# EAGLE schematic PSU2 (EAGLE 9.4.2)
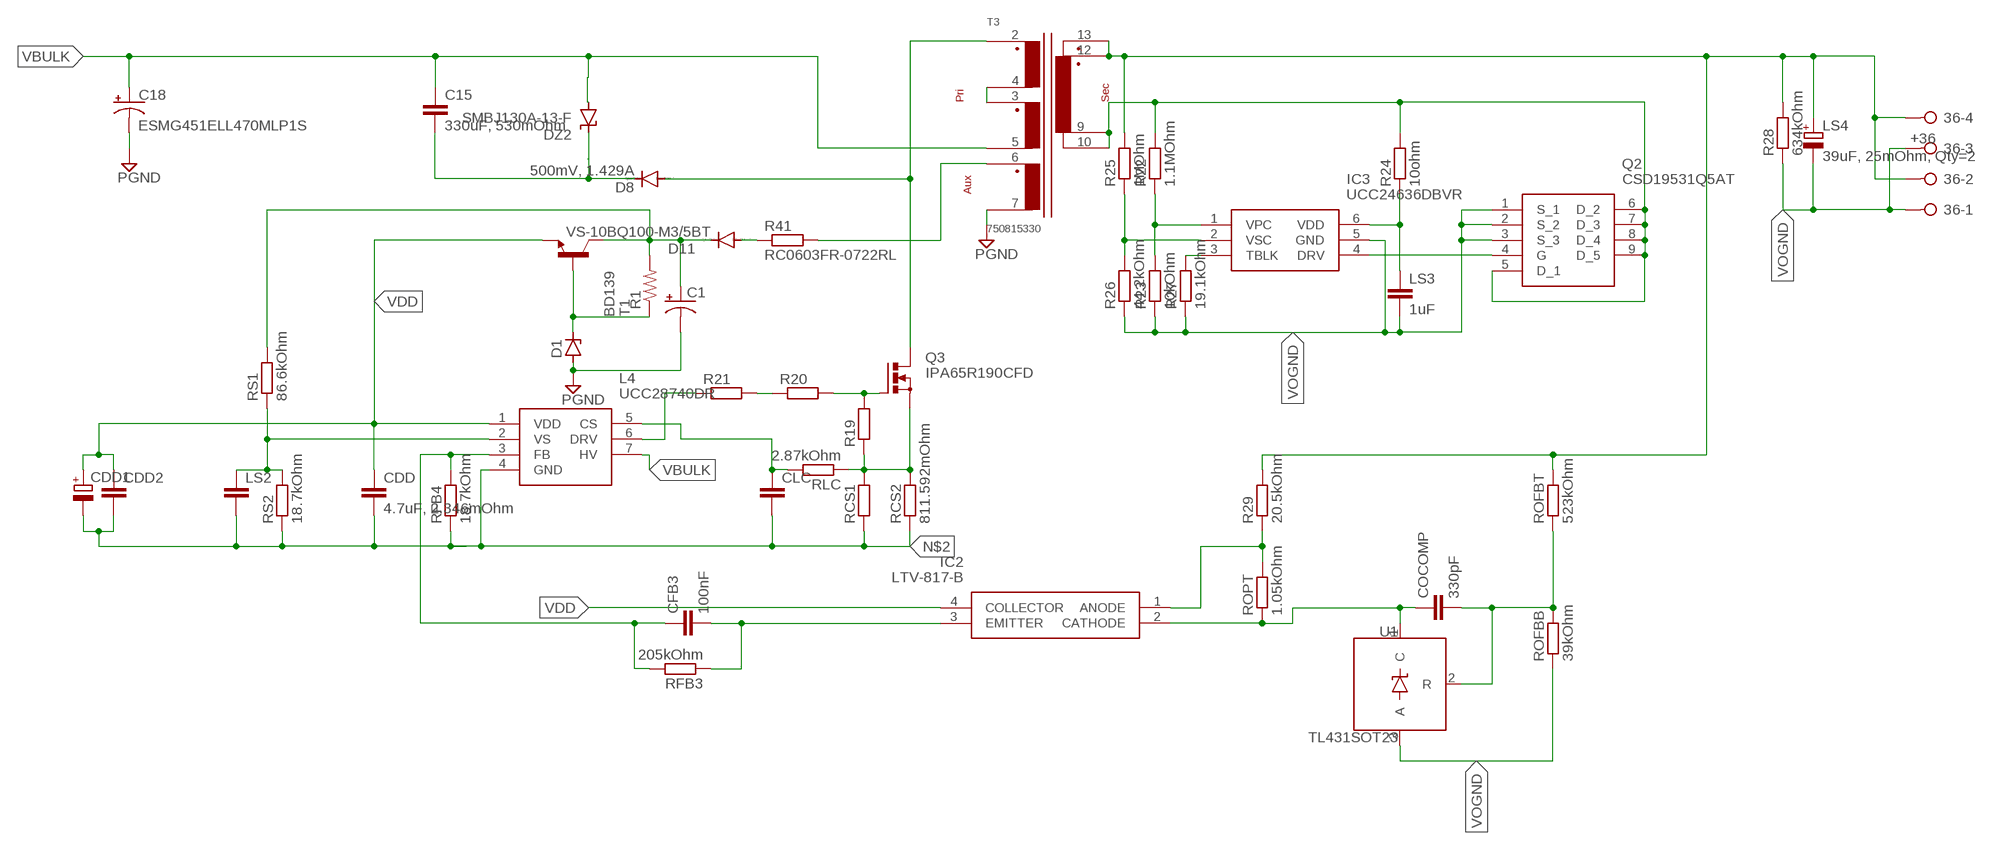
[diagram p0: schematic, sheet 1]

## Parts
36  +36  W237-04P  [W237-4P]
C1  CPOL-USE3.5-8  [E3,5-8]
C15  330uF, 530mOhm  C-EUC0805  [C0805]
C18  ESMG451ELL470MLP1S  CPOL-USE7.5-16  [E7,5-16]
CDD  4.7uF, 2.346mOhm  C-EUC0805  [C0805]
CDD1  CPOL-EUTT2D5  [TT2D5]
CDD2  C-EUC0805  [C0805]
CFB3  100nF  C-EUC0805  [C0805]
CLC  C-EUC0805  [C0805]
COCOMP  330pF  C-EUC0805  [C0805]
D1  ZENER-DIODEF126-10  [F126Z10]
D8  500mV, 1.429A  DIODE-SMC  [SMC]
D11  VS-10BQ100-M3/5BT  DIODE-SMB  [SMB]
DZ2  SMBJ130A-13-F  SUPPRESSOR-SMBJ  [SMBJ]
IC2  LTV-817-B  [DIP762W60P254L460H420Q4N]
IC3  UCC24636DBVR  [SOT95P280X145-6N]
L4  UCC28740DR  [D(R-PDSO-G7)]
LS2  C-EUC0805  [C0805]
LS3  1uF  C-EUC0805  [C0805]
LS4  39uF, 25mOhm, Qty=2  CPOL-EU153CLV-1010  [153CLV-1010]
Q2  CSD19531Q5AT  [CSD19531Q5AT]
Q3  IPA65R190CFD  PMOSFET_NTO220BV  [TO220BV]
R1  R-US_R0805  [R0805]
R19  R-EU_R0805  [R0805]
R20  R-EU_R0805  [R0805]
R21  R-EU_R0805  [R0805]
R22  1.1MOhm  R-EU_R0805  [R0805]
R23  10kOhm  R-EU_R0805  [R0805]
R24  10ohm  R-EU_R0805  [R0805]
R25  1MOhm  R-EU_R0805  [R0805]
R26  44.2kOhm  R-EU_R0805  [R0805]
R27  19.1kOhm  R-EU_R0805  [R0805]
R28  634kOhm  R-EU_R0805  [R0805]
R29  20.5kOhm  R-EU_R0805  [R0805]
R41  RC0603FR-0722RL  R-EU_R0603  [R0603]
RCS1  R-EU_R0805  [R0805]
RCS2  811.592mOhm  R-EU_R0805  [R0805]
RFB3  205kOhm  R-EU_R0805  [R0805]
RFB4  18.7kOhm  R-EU_R0805  [R0805]
RLC  2.87kOhm  R-EU_R0805  [R0805]
ROFBB  39kOhm  R-EU_R0805  [R0805]
ROFBT  523kOhm  R-EU_R0805  [R0805]
ROPT  1.05kOhm  R-EU_R0805  [R0805]
RS1  86.6kOhm  R-EU_R0805  [R0805]
RS2  18.7kOhm  R-EU_R0805  [R0805]
T1  BD139  [TO126]
T3  750815330  [EE25/13/7_THT_H_14PIN_(5644)]
U1  TL431SOT23  [SOT23-3]

## Nets
GND: T3.7 ; supply symbol labelled PGND
N$1: 36.2 36.4 LS4.+ R25.2 R28.2 R29.2 ROFBT.2 T3.12 T3.13
N$2: CDD1.- CDD2.2 CDD.2 CLC.2 L4.4(GND) LS2.2 RCS1.1 RCS2.1 RFB4.1 RS2.1
N$3: R41.2 T3.6
N$4: D1.C R1.1 T1.3(B)
N$18: CFB3.2 IC2.3(EMITTER) RFB3.1
N$19: CFB3.1 L4.3(FB) RFB3.2 RFB4.2
N$26: COCOMP.2 ROFBB.2 ROFBT.1 U1.2(R)
N$27: L4.2(VS) LS2.1 RS1.1 RS2.2
N$28: IC2.1(ANODE) R29.1 ROPT.2
N$30: COCOMP.1 IC2.2(CATHODE) ROPT.1 U1.1(C)
N$31: IC3.4(DRV) Q2.4(G)
N$32: Q2.5(D_1) Q2.6(D_2) Q2.7(D_3) Q2.8(D_4) Q2.9(D_5) R22.2 R24.2 T3.9 T3.10
N$33: T3.3 T3.4
N$43: R20.1 R21.2
N$44: Q3.G R19.2 R20.2
N$50: C15.2 D8.C DZ2.C
N$52: D8.A Q3.D T3.2
N$55: D11.A R41.1
N$CS: CLC.1 L4.5(CS) RLC.2
N$DRV: L4.6(DRV) R21.1
N$TBK: IC3.3(TBLK) R27.2
N$VODD: IC3.6(VDD) LS3.1 R24.1
N$VPC: IC3.1(VPC) R22.1 R23.2
N$VSC: IC3.2(VSC) R25.1 R26.2
PGND: C1.- C18.- D1.A
TOISENSE: Q3.S R19.1 RCS1.2 RCS2.2 RLC.1
VAUX: C1.+ D11.C R1.2 RS1.2 T1.2(C)
VBULK: C15.1 DZ2.A L4.7(HV) T3.5
VBULK1: C18.+
VDD: CDD1.+ CDD2.1 CDD.1 IC2.4(COLLECTOR) L4.1(VDD) T1.1(E)
VOGND: 36.1 36.3 IC3.5(GND) LS3.2 LS4.- Q2.1(S_1) Q2.2(S_2) Q2.3(S_3) R23.1 R26.1 R27.1 R28.1 ROFBB.1 U1.3(A)

## Library data of the parts
36 = con-wago-508:W237-04P: WAGO SREW CLAMP; OC_FARNELL: unknown; OC_NEWARK: unknown
C1 C18 = rcl:CPOL-US: POLARIZED CAPACITOR, American symbol; SPICEPREFIX: C
C15 CDD CDD2 CFB3 CLC COCOMP LS2 LS3 = rcl:C-EU: CAPACITOR, European symbol; SPICEPREFIX: C
CDD1 LS4 = rcl:CPOL-EU: POLARIZED CAPACITOR, European symbol; SPICEPREFIX: C
D1 = diode:ZENER-DIODE: Z-Diode
D8 D11 = diode:DIODE-: DIODE
DZ2 = diode:SUPPRESSOR-: Suppressor diode
IC2 = SamacSys_Parts:LTV-817-B: Lite-On LTV-817-B DC Input Transistor Output Optocoupler, Through Hole, 4-Pin PDIP Source: Datasheet <http://optoelectronics.liteon.com/upload/download/DS-70-96-0016/LTV-8X7 series 201610 .pdf>; DESCRIPTION: Lite-On LTV-817-B DC Input Transistor Output Optocoupler, Through Hole, 4-Pin PDIP; HEIGHT: 4.2mm; MANUFACTURER_NAME: Lite-On; MANUFACTURER_PART_NUMBER: LTV-817-B; MOUSER_PART_NUMBER: N/A; MOUSER_PRICE-STOCK: https://www.mouser.com/Search/Refine.aspx?Keyword=N%2FA; RS_PART_NUMBER: 6912145P; RS_PRICE-STOCK: http://uk.rs-online.com/web/p/products/6912145P
IC3 = SamacSys_Parts:UCC24636DBVR: Synchronous Rectifier Controller With Ultra-Low Standby Current Source: Datasheet <http://www.ti.com/lit/gpn/ucc24636>; DESCRIPTION: Synchronous Rectifier Controller With Ultra-Low Standby Current; HEIGHT: 1.45mm; MANUFACTURER_NAME: Texas Instruments; MANUFACTURER_PART_NUMBER: UCC24636DBVR; MOUSER_PART_NUMBER: 595-UCC24636DBVR; MOUSER_PRICE-STOCK: https://www.mouser.com/Search/Refine.aspx?Keyword=595-UCC24636DBVR
L4 = SamacSys_Parts:UCC28740DR: Constant-Voltage, Constant-Current Flyback Controller Using Opto-Coupler Feedback Source: Datasheet <http://www.ti.com/lit/gpn/ucc28740>; DESCRIPTION: Constant-Voltage, Constant-Current Flyback Controller Using Opto-Coupler Feedback; HEIGHT: mm; MANUFACTURER_NAME: Texas Instruments; MANUFACTURER_PART_NUMBER: UCC28740DR; MOUSER_PART_NUMBER: 595-UCC28740DR; MOUSER_PRICE-STOCK: https://www.mouser.com/Search/Refine.aspx?Keyword=595-UCC28740DR
Q2 = SamacSys_Parts:CSD19531Q5AT: Texas Instruments CSD19531Q5AT N-channel MOSFET Transistor, 110 A, 100 V, 8-Pin VSON Source: Datasheet <http://www.ti.com/general/docs/lit/getliterature.tsp?genericPartNumber=CSD19531Q5A&&fileType=pdf>; DESCRIPTION: Texas Instruments CSD19531Q5AT N-channel MOSFET Transistor, 110 A, 100 V, 8-Pin VSON; HEIGHT: 1mm; MANUFACTURER_NAME: Texas Instruments; MANUFACTURER_PART_NUMBER: CSD19531Q5AT; MOUSER_PART_NUMBER: 595-CSD19531Q5AT; MOUSER_PRICE-STOCK: https://www.mouser.com/Search/Refine.aspx?Keyword=595-CSD19531Q5AT; RS_PART_NUMBER: 8239259P; RS_PRICE-STOCK: http://uk.rs-online.com/web/p/products/8239259P
Q3 = transistor-power:PMOSFET_N: Power MOSFET N-Channel
R1 = rcl:R-US_: RESISTOR, American symbol; SPICEPREFIX: R
R19-R29 R41 RCS1 RCS2 RFB3 RFB4 RLC ROFBB ROFBT ROPT RS1 RS2 = rcl:R-EU_: RESISTOR, European symbol; SPICEPREFIX: R
T1 = transistor:BD139: NPN TRANSISTOR
T3 = wurth_electronics_midcom_inc_v2-1:750815330: Package Style: EE25/13/7 Mounting: THT Pins: 14 pins Bobbin: 070-5644 Best pinouts for production vary per application. Please contact Wurth Electronics Midcom, Inc. for assistance with your custom design. Website: Wurth Electronics Midcom <http://www.we-online.com/midcom> Contact us Wurth Electronics Midcom, Inc. 121 Airport Dr. Watertown, SD 57201 Phone: (605) 886-4385 Fax: (605) 886-4486 E-Mail: midcom@we-online.com
U1 = SparkFun-DiscreteSemi:TL431: TL431- Voltage Reference Precision Programmable Shunt Regulator Diode Datasheet <https://cdn.sparkfun.com/datasheets/Components/General%20IC/TL431-D.pdf> SparkFun Products: TL431-Voltage Reference PTH <https://www.sparkfun.com/products/11078> SparkFun Uh-Oh Battery Level Indicator <https://www.sparkfun.com/products/11087>